# Altium schematic sheet touch_control.SchDoc
size A4
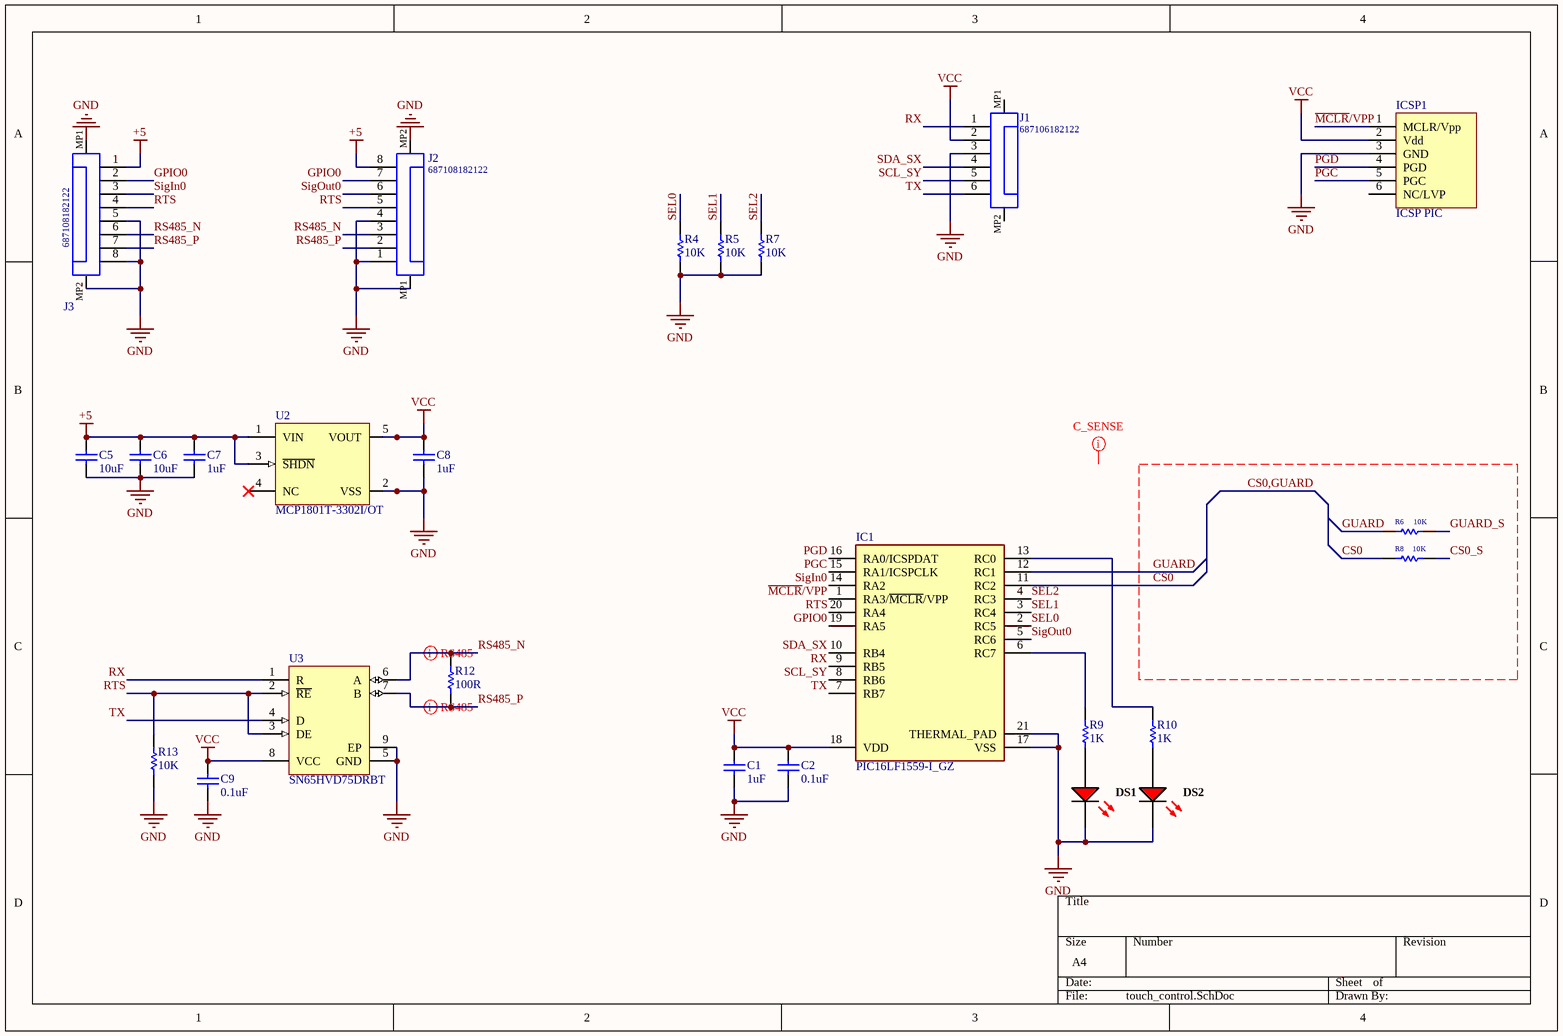
[diagram p0: touch_control.SchDoc]

## Parts
C1  1uF  [CAPC1608X95X40NL15T15]
C2  0.1uF  [CAPC1608X95X40NL15T15]
C5  10uF  [CAPC1608X90X35NL10T15]
C6  10uF  [CAPC1608X90X35NL10T15]
C7  1uF  [CAPC1608X95X40NL15T15]
C8  1uF  [CAPC1608X95X40NL15T15]
C9  0.1uF  [CAPC1608X95X40NL15T15]
DS1  APG1608SURKC/T  [KING-LED0603-25-RED_V]  (value not drawn)
DS2  APG1608SURKC/T  [KING-LED0603-25-RED_V]  (value not drawn)
IC1  PIC16LF1559-I_GZ  [QFN50P400X400X55-21N-D]
ICSP1  ICSP PIC  [TC2030-MCP]
J1  687106182122  [687106182122]
J2  687108182122  [687108182122]
J3  687108182122  [687108182122]
R4  10K  [RESC0603(1608)_N]
R5  10K  [RESC0603(1608)_N]
R6  10K  [RESC0603(1608)_N]
R7  10K  [RESC0603(1608)_N]
R8  10K  [RESC0603(1608)_N]
R9  1K  [RESC0603(1608)_N]
R10  1K  [RESC0603(1608)_N]
R12  100R  [RESC0603(1608)_N]
R13  10K  [RESC0603(1608)_N]
U2  MCP1801T-3302I/OT  [SOT-23-OT5_M]
U3  SN65HVD75DRBT  [DRB0008B_V]

## Nets
+5: C5.2 C6.2 C7.2 J2.8 J3.1 U2.1(VIN) U2.3(~{SHDN})
GND: C1.1 C2.1 C5.1 C6.1 C7.1 C8.1 C9.1 DS1.2(K) DS2.2(K) IC1.17(VSS) IC1.21(THERMAL_PAD) ICSP1.3(GND) J1.3 J2.1 J2.4 J2.MP1 J2.MP2 J3.5 J3.8 J3.MP1 J3.MP2 R4.2 R5.2 R7.2 R13.2 U2.2(VSS) U3.5(GND) U3.9(EP)
VCC: C1.2 C2.2 C8.2 C9.2 IC1.18(VDD) ICSP1.2(Vdd) J1.2 U2.5(VOUT) U3.8(VCC)
CS0: IC1.11(RC2) R8.1
CS0_S: R8.2
GPIO0: IC1.19(RA5) J2.7 J3.2
GUARD: IC1.12(RC1) R6.1
GUARD_S: R6.2
~{MCLR}/VPP: IC1.1(RA3/~{MCLR}/VPP) ICSP1.1(MCLR/Vpp)
PGC: IC1.15(RA1/ICSPCLK) ICSP1.5(PGC)
PGD: IC1.16(RA0/ICSPDAT) ICSP1.4(PGD)
RS485_N: J2.3 J3.6 R12.1 U3.6(A)
RS485_P: J2.2 J3.7 R12.2 U3.7(B)
RTS: IC1.20(RA4) J2.5 J3.4 R13.1 U3.2(~{RE}) U3.3(DE)
RX: IC1.9(RB5) J1.1 U3.1(R)
SCL_SY: IC1.8(RB6) J1.5
SDA_SX: IC1.10(RB4) J1.4
SEL0: IC1.2(RC5) R4.1
SEL1: IC1.3(RC4) R5.1
SEL2: IC1.4(RC3) R7.1
SigIn0: IC1.14(RA2) J3.3
SigOut0: IC1.5(RC6) J2.6
TX: IC1.7(RB7) J1.6 U3.4(D)
NetDS1_1: DS1.1(A) R9.2
NetDS2_1: DS2.1(A) R10.2
NetIC1_6: IC1.6(RC7) R9.1
NetIC1_13: IC1.13(RC0) R10.1

Not connected (* = marked no-connect by the designer): ICSP1 6(NC/LVP); J1 MP1 MP2; U2 4(NC)*

## Buses and harness runs
bus CS0,GUARD

## Layout directives
net class C_SENSE: (no net found under the mark)
differential pair; differential pair class *: RS485_N, RS485_P

## Library data of the parts
C1 C7 C8 = CMP-2006-00046-1: Manufacturer: Vitramon; Part Number: VJ0603G105KXYCW1BC
C2 C9 = CMP-2006-01884-1: Part Number: VJ0603Y104JXQCW1BC; Manufacturer: Vitramon
C5 C6 = CMP-2006-02792-1: Part Number: GRM188R60J106ME47D; Manufacturer: Murata
DS1 DS2 = CMP-0404-00004-1: Ultra Thin Hyper Red SMD Chip LED Lamp, 2 to 2.5 V, -40 to 85 degC, Body 1.6 x 0.8 mm, 0.28 mm Thickness, RoHS, Tape and Reel; Manufacturer: Kingbright; Dice: Hyper Red (AlGaInP); IR (Max): 10 uA; Luminous Intensity mcd @ 20 mA (Min.): 55; Lens Type: Water Clear; Viewing Angle: 120; Luminous Intensity mcd @ 20 mA (Typ.): 110; ComponentLink2Description: Datasheet; ComponentLink3URL: http://www.kingbrightusa.com/images/catalog/SPEC/APG1608SURKC-T.pdf; Packing: Tape and Reel; Mounting Technology: Surface Mount; PackageVersion: Rev. V.5A; ComponentLink1Description: Manufacturer URL; ComponentLink2URL: http://www.kingbrightusa.com/images/catalog/SPEC/APG1608SURKC-T.pdf; ComponentLink3Description: Package Specification; PackageDescription: 2-Pin SMT, Body 1.6 x 0.8 mm, 0.28mm Thickness, Red; PackageReference: LED0603-25-RED; DatasheetVersion: Rev. V.5A; Operating Temperature: -40 to 85 degC; PartNumber: APG1608SURKC/T; ComponentLink1URL: http://www.kingbrightusa.com/; Forward Voltage: 2 to 2.5 V; RoHS: TRUE
IC1 = PIC16LF1559-I_GZ: Integrated Circuit; Manufacturer_Name: Microchip; Manufacturer_Part_Number: PIC16LF1559-I/GZ; Datasheet Link: http://ww1.microchip.com/downloads/en/DeviceDoc/40001761E.pdf; Height: 0.55mm; Mouser Part Number: 579-PIC16LF1559-I/GZ; Mouser Price/Stock: https://www.mouser.com/Search/Refine.aspx?Keyword=579-PIC16LF1559-I%2FGZ
J1 = CMP-1502-01645-1: SMT ZIF Connectors WR-FPC, Horizontal, Back Locking Dual Contact, pitch 0.5 mm, 6 pins; Manufacturer: Wurth Elektronik; Pitch: 0.5mm; Working Voltage: 50VAC; Withstanding Voltage: 250VAC; Contact Resistance: 30mOhm; Pin Number: 6; Rated Current: 0.5A; Package Reference: 687106182122; Contact Design: BackLockingDualContact; Manufacturer URL: http://www.we-online.de; Datasheet URL: https://katalog.we-online.de/em/datasheet/687106182122.pdf; Publisher: WurthElektronik; Part Number: 687106182122; Mounting Technology: SMT; Orientation: Horizontal; Operating Temperature: -55to85degC; Packaging: TapeandReel
J2 J3 = CMP-1502-01646-1: SMT ZIF Connectors WR-FPC, Horizontal, Back Locking Dual Contact, pitch 0.5 mm, 8 pins; Manufacturer: Wurth Elektronik; Contact Resistance: 30mOhm; Working Voltage: 50VAC; Withstanding Voltage: 250VAC; Pin Number: 8; Rated Current: 0.5A; Pitch: 0.5mm; Manufacturer URL: http://www.we-online.de; Mounting Technology: SMT; Contact Design: BackLockingDualContact; Part Number: 687108182122; Package Reference: 687108182122; Orientation: Horizontal; Operating Temperature: -55to85degC; Datasheet URL: https://katalog.we-online.de/em/datasheet/687108182122.pdf; Publisher: WurthElektronik; Packaging: TapeandReel
R4-R10 R12 R13 = CMP-1012-00623-1: 10K 0.1W 1% 0603 (1608 Metric)  SMD; Value: 10000.00 Ohm; Case-EIA: 0603; Case-Metric: 1608; Power: 0.1 W; Tolerance: 1 %; Technology: SMT
U2 = CMP-0136-00719-1: 150 mA, High PSRR, Low Quiescent Current LDO, 5-Pin SOT-23, Industrial Temperature, Tape and Reel; Code_IPC: SOT23-5; PackageVersion: revBB, Aug-2009; PackageReference: SOT-23-OT5; DatasheetVersion: revC, Jan-2009; PackageDescription: 5-Lead Plastic Small Outline Transistor (OT) [SOT-23]
U3 = CMP-0694-00015-2: 3.3 V Supply RS-485 with IEC ESD Protection, 20 Mbps, -40 to 125 degC, 8-Pin SON, RoHS, Tape and Reel; Manufacturer: Texas Instruments; VI: -7 to 12 V; ESD: 15 kV; VCC: 3 to 3.6 V; ICC (Max) (mA): 0.95; Signaling Rate (Max) (Mbps): 20; No. of TX: 1; Packing: Tape and Reel; ComponentLink3Description: Package Specification; RoHS: TRUE; PartNumber: SN65HVD75DRBT; ComponentLink2URL: http://www.ti.com/lit/ds/sllse11c/sllse11c.pdf; ComponentLink2Description: Datasheet; ComponentLink3URL: http://www.ti.com/lit/ds/sllse11c/sllse11c.pdf; PackageVersion: 4203482-2/K; DatasheetVersion: SLLSE11C; PackageReference: DRB0008B; PackageDescription: 8-Pin Plastic Small Outline No-Lead, Body 3 x 3 mm, Pitch 0.65 mm; ComponentLink1Description: Manufacturer URL; Operating Temperature Range: -40 to 125 degC; No. of RX: 1; Mounting Technology: Surface Mount; ComponentLink1URL: http://www.ti.com/